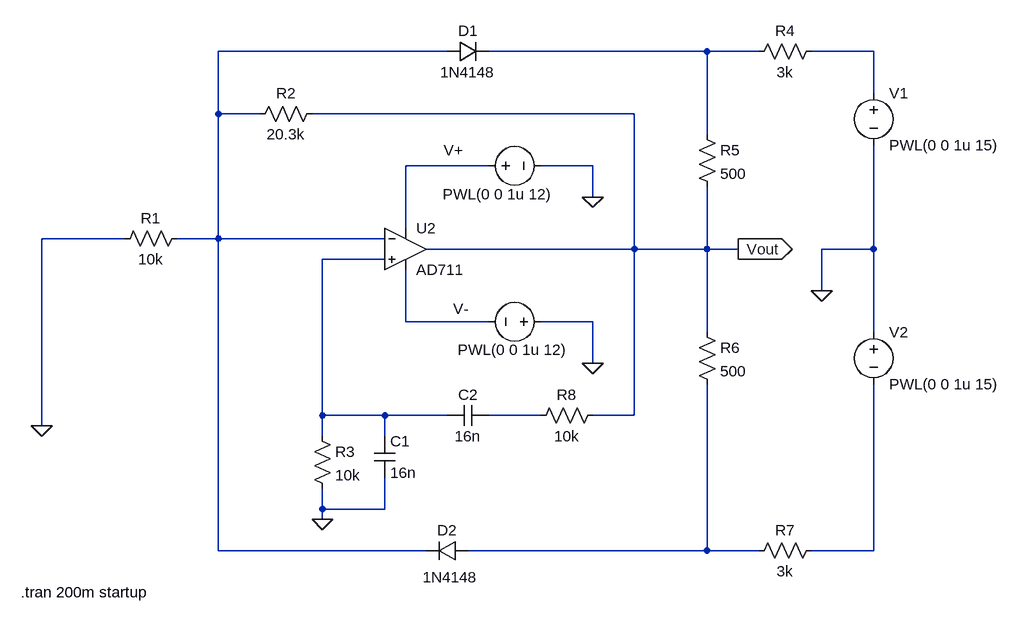
[diagram p0: schematic Puente Wien Limitado.asc]
Puente Wien Limitado.asc, the LTspice schematic file:
Version 4
SHEET 1 1432 776
WIRE -192 -112 -544 -112
WIRE 208 -112 -128 -112
WIRE 288 -112 208 -112
WIRE 464 -112 368 -112
WIRE 464 -48 464 -112
WIRE -544 -16 -544 -112
WIRE -480 -16 -544 -16
WIRE 96 -16 -400 -16
WIRE 208 16 208 -112
WIRE -128 64 -256 64
WIRE 32 64 -48 64
WIRE 32 112 32 64
WIRE -256 160 -256 64
WIRE -688 176 -816 176
WIRE -544 176 -544 -16
WIRE -544 176 -608 176
WIRE -288 176 -544 176
WIRE 96 192 96 -16
WIRE 96 192 -224 192
WIRE 208 192 208 96
WIRE 208 192 96 192
WIRE 256 192 208 192
WIRE 464 192 464 32
WIRE 464 192 384 192
WIRE -288 208 -384 208
WIRE 384 256 384 192
WIRE -256 304 -256 224
WIRE -128 304 -256 304
WIRE 32 304 -48 304
WIRE 208 320 208 192
WIRE 464 320 464 192
WIRE 32 368 32 304
WIRE -384 448 -384 208
WIRE -288 448 -384 448
WIRE -192 448 -288 448
WIRE -48 448 -128 448
WIRE 96 448 96 192
WIRE 96 448 32 448
WIRE -816 464 -816 176
WIRE -384 480 -384 448
WIRE -288 480 -288 448
WIRE -384 592 -384 560
WIRE -288 592 -288 544
WIRE -288 592 -384 592
WIRE -384 608 -384 592
WIRE -544 656 -544 176
WIRE -224 656 -544 656
WIRE 208 656 208 400
WIRE 208 656 -160 656
WIRE 288 656 208 656
WIRE 464 656 464 400
WIRE 464 656 368 656
FLAG -816 464 0
FLAG 32 112 0
FLAG 32 368 0
FLAG 384 256 0
FLAG 256 192 Vout
IOPIN 256 192 Out
FLAG -384 608 0
SYMBOL res -592 160 R90
WINDOW 0 0 56 VBottom 2
WINDOW 3 32 56 VTop 2
SYMATTR InstName R1
SYMATTR Value 10k
SYMBOL res -384 -32 R90
WINDOW 0 0 56 VBottom 2
WINDOW 3 32 56 VTop 2
SYMATTR InstName R2
SYMATTR Value 20.3k
SYMBOL res -400 464 R0
SYMATTR InstName R3
SYMATTR Value 10k
SYMBOL res 384 -128 R90
WINDOW 0 0 56 VBottom 2
WINDOW 3 32 56 VTop 2
SYMATTR InstName R4
SYMATTR Value 3k
SYMBOL res 192 0 R0
SYMATTR InstName R5
SYMATTR Value 500
SYMBOL diode -192 -96 R270
WINDOW 0 32 32 VTop 2
WINDOW 3 0 32 VBottom 2
SYMATTR InstName D1
SYMATTR Value 1N4148
SYMBOL diode -160 640 R90
WINDOW 0 0 32 VBottom 2
WINDOW 3 41 27 VTop 2
SYMATTR InstName D2
SYMATTR Value 1N4148
SYMBOL voltage -144 64 R270
WINDOW 123 0 0 Left 0
WINDOW 39 0 0 Left 0
WINDOW 0 24 -53 VRight 2
WINDOW 3 -44 -55 VRight 2
SYMATTR InstName V+
SYMATTR Value PWL(0 0 1u 12)
SYMBOL voltage -32 304 R90
WINDOW 0 -20 127 VRight 2
WINDOW 3 43 -26 VRight 2
WINDOW 123 0 0 Left 0
WINDOW 39 0 0 Left 0
SYMATTR InstName V-
SYMATTR Value PWL(0 0 1u 12)
SYMBOL voltage 464 304 R0
WINDOW 123 0 0 Left 0
WINDOW 39 0 0 Left 0
SYMATTR InstName V2
SYMATTR Value PWL(0 0 1u 15)
SYMBOL voltage 464 -64 R0
WINDOW 123 0 0 Left 0
WINDOW 39 0 0 Left 0
SYMATTR InstName V1
SYMATTR Value PWL(0 0 1u 15)
SYMBOL res 192 304 R0
SYMATTR InstName R6
SYMATTR Value 500
SYMBOL res 384 640 R90
WINDOW 0 0 56 VBottom 2
WINDOW 3 32 56 VTop 2
SYMATTR InstName R7
SYMATTR Value 3k
SYMBOL res 48 432 R90
WINDOW 0 0 56 VBottom 2
WINDOW 3 32 56 VTop 2
SYMATTR InstName R8
SYMATTR Value 10k
SYMBOL cap -304 480 R0
SYMATTR InstName C1
SYMATTR Value 16n
SYMBOL cap -192 464 R270
WINDOW 0 32 32 VTop 2
WINDOW 3 0 32 VBottom 2
SYMATTR InstName C2
SYMATTR Value 16n
SYMBOL OpAmps\\AD711 -256 128 R0
SYMATTR InstName U2
TEXT -848 720 Left 2 !.tran 200m startup

The netlist it stands for:
* Puente Wien Limitado.asc
R1 N001 0 10k
R2 Vout N001 20.3k
R3 N005 0 10k
R4 N003 N002 3k
R5 N002 Vout 500
D1 N001 N002 1N4148
D2 N008 N001 1N4148
V+ N004 0 PWL(0 0 1u 12)
V- 0 N006 PWL(0 0 1u 12)
V2 0 N009 PWL(0 0 1u 15)
V1 N003 0 PWL(0 0 1u 15)
R6 Vout N008 500
R7 N009 N008 3k
R8 Vout N007 10k
C1 N005 0 16n
C2 N005 N007 16n
XU2 N005 N001 N004 N006 Vout AD712  ; AD711, pins In+ In- V+ V- OUT
.model D D
.lib standard.dio
.tran 200m startup
.lib ADI1.lib
.backanno
.end